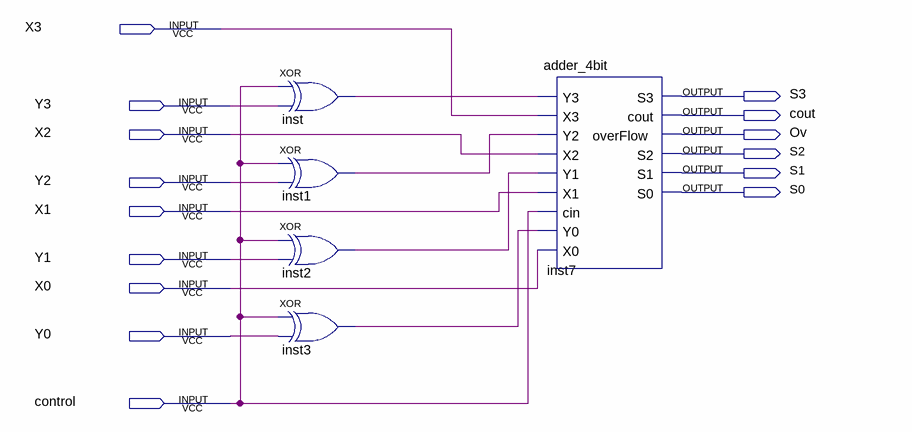
[diagram p0: schematic sheet]
// Quartus schematic add_sub.bdf as structural Verilog: 5 symbols, 15 pins
module add_sub (
  input  X3,
  input  Y3,
  input  X2,
  input  Y2,
  input  X1,
  input  Y1,
  input  X0,
  input  Y0,
  input  control,
  output S3,
  output cout,
  output Ov,
  output S2,
  output S1,
  output S0
);

  wire inst1_out, inst2_out, inst3_out, inst_out;

  xor inst (inst_out, control, Y3);
  xor inst1 (inst1_out, control, Y2);
  xor inst2 (inst2_out, control, Y1);
  xor inst3 (inst3_out, control, Y0);
  adder_4bit inst7 (
    .Y3(inst_out), .X3(X3), .Y2(inst1_out), .X2(X2), .Y1(inst2_out), .X1(X1), .cin(control), .Y0(inst3_out),
    .X0(X0), .S3(S3), .cout(cout), .overFlow(Ov), .S2(S2), .S1(S1), .S0(S0));
endmodule
